# EAGLE design 6in-6out_1.1 (EAGLE 5.02)
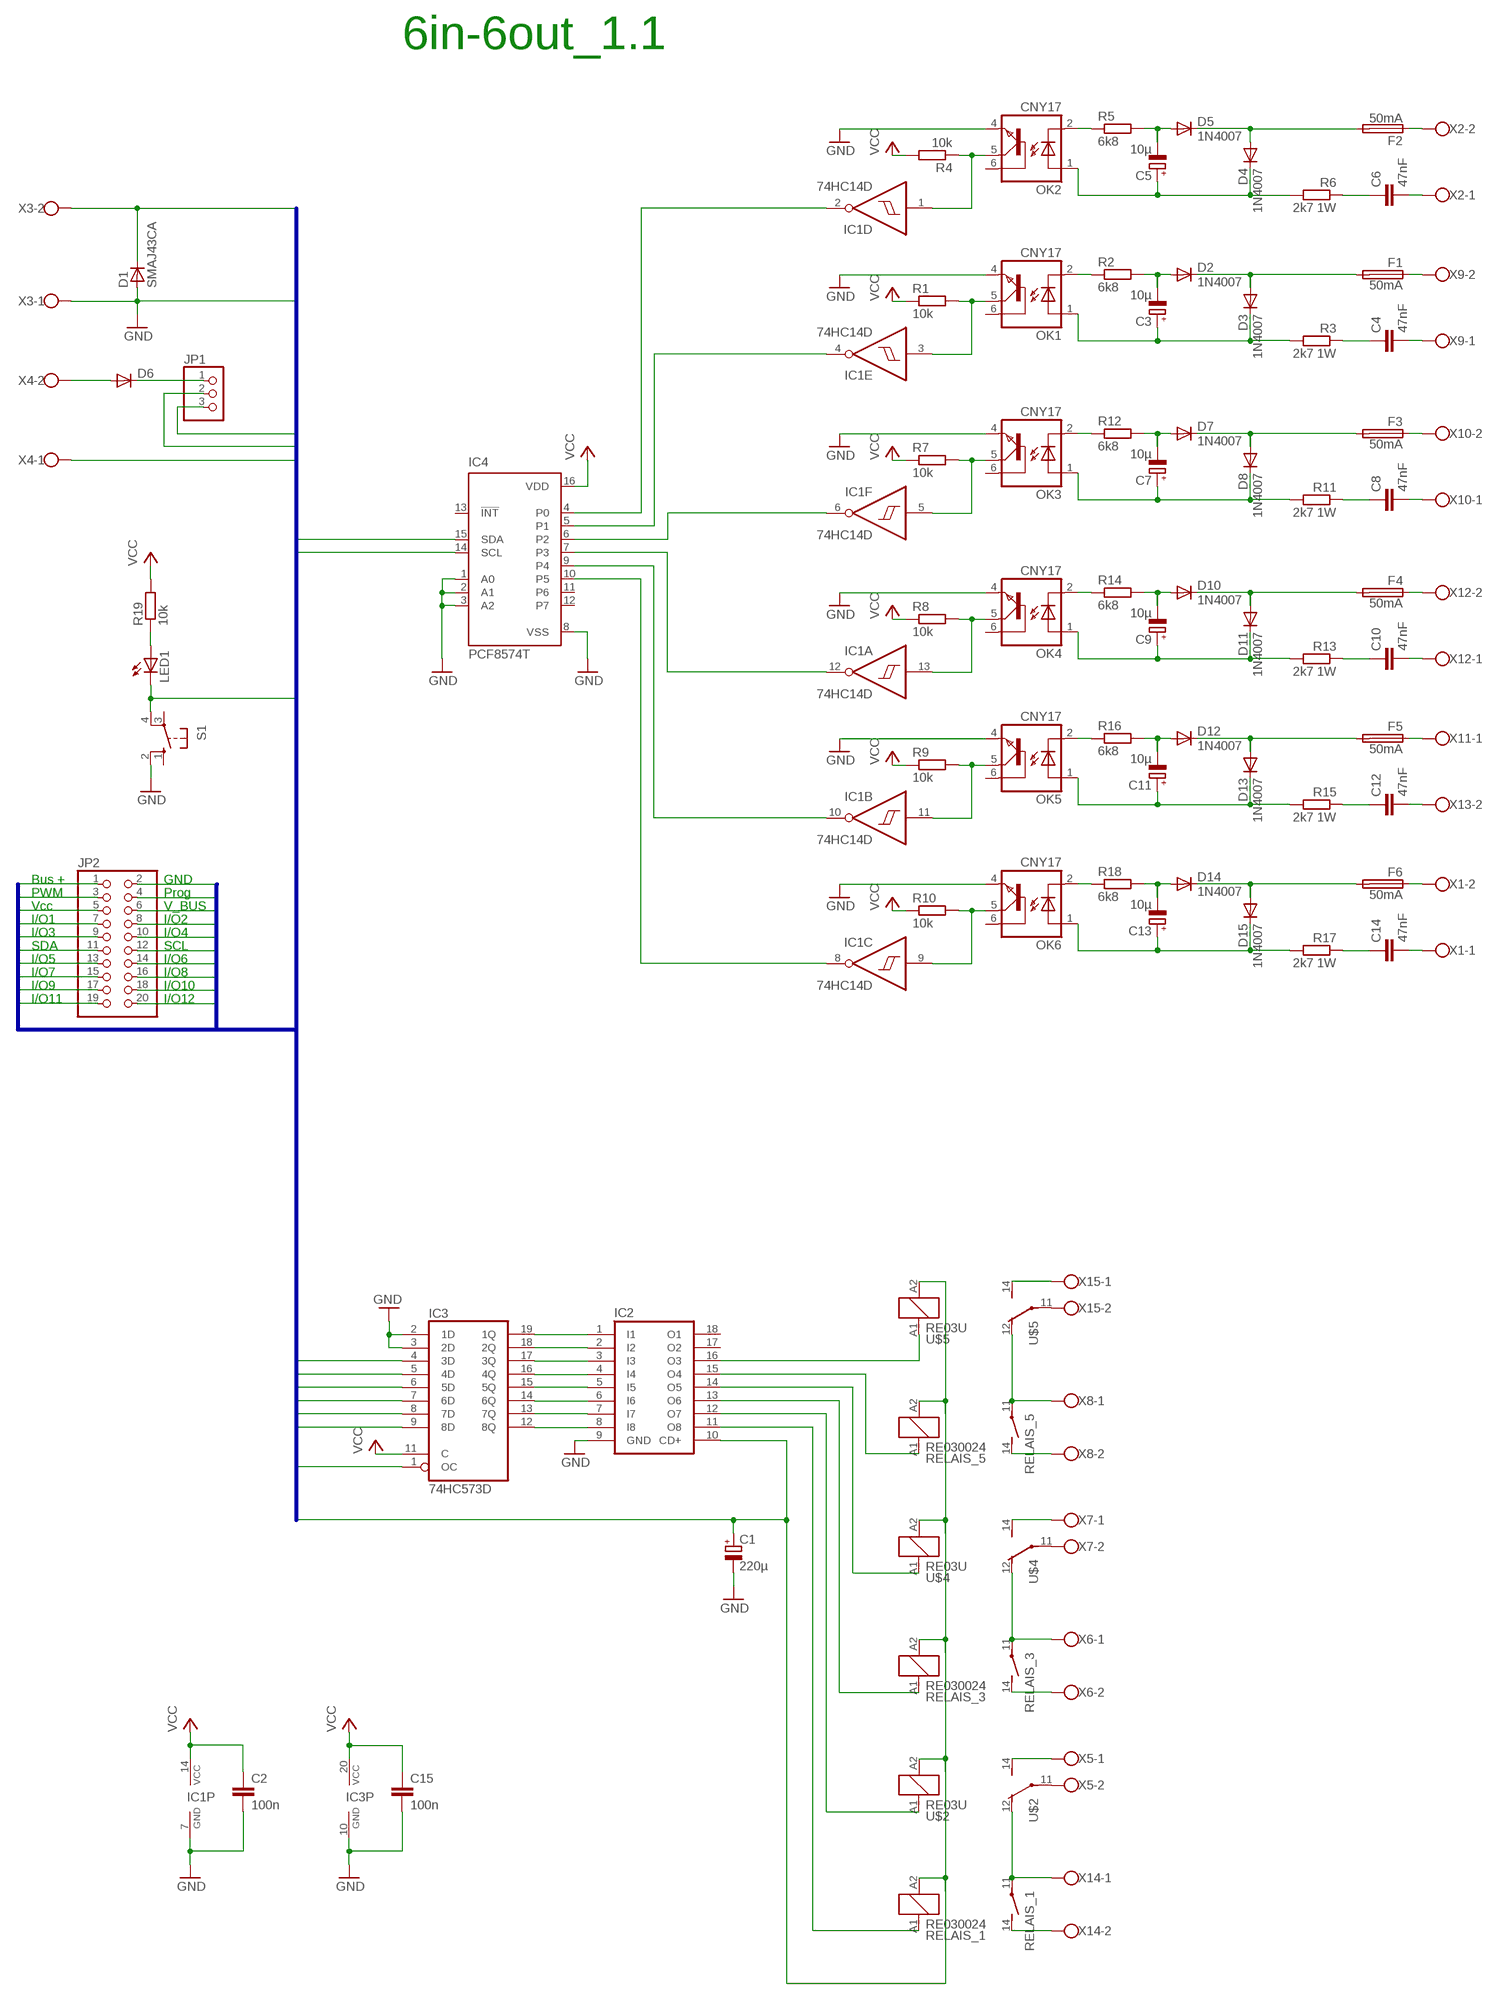
[diagram p0: schematic, sheet 1]

## Parts
C1  220µ  CPOL-EUE3.5-10  [E3,5-10]
C2  100n  C-EUC1206  [C1206]
C3  10µ  CPOL-EUE2-4  [E2-4]
C4  47nF  C-EU075-063X106  [C075-063X106]
C5  10µ  CPOL-EUE2-4  [E2-4]
C6  47nF  C-EU075-063X106  [C075-063X106]
C7  10µ  CPOL-EUE2-4  [E2-4]
C8  47nF  C-EU075-063X106  [C075-063X106]
C9  10µ  CPOL-EUE2-4  [E2-4]
C10  47nF  C-EU075-063X106  [C075-063X106]
C11  10µ  CPOL-EUE2-4  [E2-4]
C12  47nF  C-EU075-063X106  [C075-063X106]
C13  10µ  CPOL-EUE2-4  [E2-4]
C14  47nF  C-EU075-063X106  [C075-063X106]
C15  100n  C-EUC1206  [C1206]
D1  SMAJ43CA  D-SMB  [SMB]
D2  1N4007  DIODE-D-2.5  [D-2.5]
D3  1N4007  DIODE-D-2.5  [D-2.5]
D4  1N4007  DIODE-D-2.5  [D-2.5]
D5  1N4007  DIODE-D-2.5  [D-2.5]
D6  DIODE-MINIMELF  [MINIMELF]
D7  1N4007  DIODE-D-2.5  [D-2.5]
D8  1N4007  DIODE-D-2.5  [D-2.5]
D10  1N4007  DIODE-D-2.5  [D-2.5]
D11  1N4007  DIODE-D-2.5  [D-2.5]
D12  1N4007  DIODE-D-2.5  [D-2.5]
D13  1N4007  DIODE-D-2.5  [D-2.5]
D14  1N4007  DIODE-D-2.5  [D-2.5]
D15  1N4007  DIODE-D-2.5  [D-2.5]
F1  50mA  FUSE  [0617V]
F2  50mA  FUSE  [0617V]
F3  50mA  FUSE  [0617V]
F4  50mA  FUSE  [0617V]
F5  50mA  FUSE  [0617V]
F6  50mA  FUSE  [0617V]
IC1  74HC14D  [SO14]
IC2  ULN2803AD  [SO18W]
IC3  74HC573D  [SO20W]
IC4  PCF8574T  [SO16W]
JP1  PINHD-1X3  [1X03]
JP2  PINHD-2X10  [2X10]
LED1  LED3MM  [LED3MM]
OK1  CNY17  [DIL06]
OK2  CNY17  [DIL06]
OK3  CNY17  [DIL06]
OK4  CNY17  [DIL06]
OK5  CNY17  [DIL06]
OK6  CNY17  [DIL06]
R1  10k  R-EU_M1206  [M1206]
R2  6k8  R-EU_0207/2V  [0207/2V]
R3  2k7 1W  R-EU_0207/2V  [0207/2V]
R4  10k  R-EU_M1206  [M1206]
R5  6k8  R-EU_0207/2V  [0207/2V]
R6  2k7 1W  R-EU_0207/2V  [0207/2V]
R7  10k  R-EU_M1206  [M1206]
R8  10k  R-EU_M1206  [M1206]
R9  10k  R-EU_M1206  [M1206]
R10  10k  R-EU_M1206  [M1206]
R11  2k7 1W  R-EU_0207/2V  [0207/2V]
R12  6k8  R-EU_0207/2V  [0207/2V]
R13  2k7 1W  R-EU_0207/2V  [0207/2V]
R14  6k8  R-EU_0207/2V  [0207/2V]
R15  2k7 1W  R-EU_0207/2V  [0207/2V]
R16  6k8  R-EU_0207/2V  [0207/2V]
R17  2k7 1W  R-EU_0207/2V  [0207/2V]
R18  6k8  R-EU_0207/2V  [0207/2V]
R19  10k  R-EU_M1206  [M1206]
RELAIS_1  RE030024  [RE-SCHRACK]
RELAIS_3  RE030024  [RE-SCHRACK]
RELAIS_5  RE030024  [RE-SCHRACK]
S1  10-XX  [B3F-10XX]
U$2  RE03U  [G5Q_1_EU]
U$4  RE03U  [G5Q_1_EU]
U$5  RE03U  [G5Q_1_EU]
X1  W237-02P  [W237-132]
X2  W237-3E  [W237-3E]
X3  W237-02P  [W237-132]
X4  W237-02P  [W237-132]
X5  W237-02P  [W237-132]
X6  W237-02P  [W237-132]
X7  W237-02P  [W237-132]
X8  W237-02P  [W237-132]
X9  W237-3E  [W237-3E]
X10  W237-3E  [W237-3E]
X11  W237-02P  [W237-132]
X12  W237-02P  [W237-132]
X13  W237-02P  [W237-132]
X14  W237-02P  [W237-132]
X15  W237-02P  [W237-132]

## Nets
EIB+: D1.1(C) JP2.1 X3.2
GND: C1.- C2.2 C15.2 D1.2(A) IC1.7(P:GND) IC2.9(GND) IC3.2(1D) IC3.3(2D) IC3.10(GND) IC4.1(A0) IC4.2(A1) IC4.3(A2) IC4.8(VSS) JP2.2 OK1.4(EMI) OK2.4(EMI) OK3.4(EMI) OK4.4(EMI) OK5.4(EMI) OK6.4(EMI) S1.2(S1) X3.1 X4.1
IO1: JP2.7
IO2: IC3.4(3D) JP2.8
IO3: IC3.5(4D) JP2.9
IO4: IC3.6(5D) JP2.10
IO5: IC3.7(6D) JP2.13
IO6: IC3.8(7D) JP2.14
IO7: IC3.9(8D) JP2.15
IO8: JP2.16
IO9: JP2.17
IO10: JP2.18
IO11: JP2.19
IO12: JP2.20
N$1: OK1.2(C) R2.1
N$2: IC1.12(A:O) IC4.7(P3)
N$3: C3.- D2.A R2.2
N$4: OK3.2(C) R12.1
N$5: D2.C D3.A F1.2
N$6: U$2.14(14:S) X5.1
N$7: C4.1 R3.1
N$8: C7.- D7.A R12.2
N$9: D7.C D8.A F3.2
N$10: OK2.2(C) R5.1
N$11: C6.1 R6.1
N$12: D6.A X4.2
N$13: C5.- D5.A R5.2
N$14: IC2.16(O3) U$5.A1
N$15: D6.C JP1.1
N$17: IC2.15(O4) RELAIS_5.A1
N$18: D4.A D5.C F2.2
N$19: IC2.12(O7) U$2.A1
N$20: C5.+ D4.C OK2.1(A) R6.2
N$21: IC2.1(I1) IC3.19(1Q)
N$22: IC2.2(I2) IC3.18(2Q)
N$23: C7.+ D8.C OK3.1(A) R11.2
N$24: C3.+ D3.C OK1.1(A) R3.2
N$25: U$2.11(14:P) X5.2
N$26: RELAIS_5.14(2:S) X8.2
N$27: IC1.5(F:I) OK3.5(COL) R7.2
N$28: IC1.1(D:I) OK2.5(COL) R4.1
N$29: IC1.3(E:I) OK1.5(COL) R1.2
N$30: RELAIS_5.11(2:P) U$5.12(14:O) X8.1
N$31: C8.1 R11.1
N$32: U$4.11(14:P) X7.2
N$33: OK4.2(C) R14.1
N$34: C9.- D10.A R14.2
N$35: D10.C D11.A F4.2
N$36: C9.+ D11.C OK4.1(A) R13.2
N$37: IC1.13(A:I) OK4.5(COL) R8.2
N$38: C10.1 R13.1
N$39: U$4.14(14:S) X7.1
N$40: RELAIS_3.14(2:S) X6.2
N$41: OK5.2(C) R16.1
N$42: C11.- D12.A R16.2
N$43: D12.C D13.A F5.2
N$44: C11.+ D13.C OK5.1(A) R15.2
N$45: IC1.11(B:I) OK5.5(COL) R9.2
N$46: RELAIS_3.11(2:P) U$4.12(14:O) X6.1
N$47: U$5.11(14:P) X15.2
N$48: C12.1 R15.1
N$49: OK6.2(C) R18.1
N$50: C13.- D14.A R18.2
N$51: D14.C D15.A F6.2
N$52: C13.+ D15.C OK6.1(A) R17.2
N$53: IC1.9(C:I) OK6.5(COL) R10.2
N$54: U$5.14(14:S) X15.1
N$55: RELAIS_1.14(2:S) X14.2
N$56: C14.1 R17.1
N$57: RELAIS_1.11(2:P) U$2.12(14:O) X14.1
N$58: F1.1 X9.2
N$59: IC2.3(I3) IC3.17(3Q)
N$60: IC2.13(O6) RELAIS_3.A1
N$61: IC2.4(I4) IC3.16(4Q)
N$62: F2.1 X2.2
N$63: C6.2 X2.1
N$64: IC2.5(I5) IC3.15(5Q)
N$65: IC2.14(O5) U$4.A1
N$66: IC2.6(I6) IC3.14(6Q)
N$67: C4.2 X9.1
N$68: F3.1 X10.2
N$69: IC2.7(I7) IC3.13(7Q)
N$70: IC2.8(I8) IC3.12(8Q)
N$71: C8.2 X10.1
N$72: F4.1 X12.2
N$73: C10.2 X12.1
N$74: C12.2 X13.2
N$75: F5.1 X11.1
N$76: F6.1 X1.2
N$77: C14.2 X1.1
N$78: LED1.A R19.1
N$81: IC1.2(D:O) IC4.4(P0)
N$82: IC1.4(E:O) IC4.5(P1)
N$83: IC1.6(F:O) IC4.6(P2)
N$84: IC1.10(B:O) IC4.9(P4)
N$85: IC1.8(C:O) IC4.10(P5)
PROG: JP2.4
PROG1: LED1.K(C) S1.4(P1)
PWM: IC3.1(OC) JP2.3
R3: IC2.11(O8) RELAIS_1.A1
SCL: IC4.14(SCL) JP2.12
SDA: IC4.15(SDA) JP2.11
V_BUS: JP1.3 JP2.6
VCC: C2.1 C15.1 IC1.14(P:VCC) IC3.11(C) IC3.20(VCC) IC4.16(VDD) JP2.5 R1.1 R4.2 R7.1 R8.1 R9.1 R10.1 R19.2
VDD: C1.+ IC2.10(CD+) JP1.2 RELAIS_1.A2 RELAIS_3.A2 RELAIS_5.A2 U$2.A2 U$4.A2 U$5.A2
Unconnected: IC2.17(O2) IC2.18(O1) IC4.11(P6) IC4.12(P7) IC4.13(!INT) OK1.6(BAS) OK2.6(BAS) OK3.6(BAS) OK4.6(BAS) OK5.6(BAS) OK6.6(BAS) S1.1(S) S1.3(P) X2.3 X9.3 X10.3 X11.2 X13.1

## Buses
IO[1..12],PWM,PROG,VDD,VCC,GND,EIB+,V_BUS,SDA,SCL

## Notes on the sheet
- 6in-6out_1.1
- Bus + | GND
- PWM | Prog
- Vcc | V_BUS
- I/O1 | I/O2
- I/O3 | I/O4
- SDA | SCL
- I/O5 | I/O6
- I/O7 | I/O8
- I/O9 | I/O10
- I/O11 | I/O12

## Library data of the parts
C1 C3 C5 C7 C9 C11 C13 = rcl:CPOL-EU: POLARIZED CAPACITOR, European symbol
C2 C4 C6 C8 C10 C12 C14 C15 = rcl:C-EU: CAPACITOR, European symbol
D1 = semicon-smd-ipc:D-: DIODE unfilled
D2-D8 D10-D15 = diode:DIODE-: DIODE
F1-F6 = fuse:FUSE: Fuse
IC1 = 74xx-eu:74*14: Hex schmitt trigger INVERTER
IC2 = uln-udn:ULN2803A: DRIVER ARRAY
IC3 = 74xx-eu:74*573: 8-bit D latch BUS DRIVER
IC4 = micro-philips:PCF8574: I2C-Bus Remote 8-bit I/O expander http://www.semiconductors.philips.com/acrobat_download/datasheets/PCF8574_4.pdf
JP1 = pinhead:PINHD-1X3: PIN HEADER
JP2 = pinhead:PINHD-2X10: PIN HEADER
LED1 = led:LED: LED OSRAM: - CHIPLED LG R971, LG N971, LY N971, LG Q971, LY Q971, LO R971, LY R971 LH N974, LH R974 LS Q976, LO Q976, LY Q976 LO Q996 - Hyper CHIPLED LW Q18S LB Q993, LB Q99A, LB R99A - SideLED LS A670, LO A670, LY A670, LG A670, LP A670 LB A673, LV A673, LT A673, LW A673 LH A674 LY A675 LS A676, LA A676, LO A676, LY A676, LW A676 LS A679, LY A679, LG A679 - Hyper Micro SIDELED® LS Y876, LA Y876, LO Y876, LY Y876 LT Y87S - SmartLED LW L88C, LW L88S LB L89C, LB L89S, LG L890 LS L89K, LO L89K, LY L89K LS L896, LA L896, LO L896, LY L896 - TOPLED LS T670, LO T670, LY T670, LG T670, LP T670 LSG T670, LSP T670, LSY T670, LOP T670, LYG T670 LG T671, LOG T671, LSG T671 LB T673, LV T673, LT T673, LW T673 LH T674 LS T676, LA T676, LO T676, LY T676, LB T676, LH T676, LSB T676, LW T676 LB T67C, LV T67C, LT T67C, LS T67K, LO T67K, LY T67K, LW E67C LS E67B, LA E67B, LO E67B, LY E67B, LB E67C, LV E67C, LT E67C LW T67C LS T679, LY T679, LG T679 LS T770, LO T770, LY T770, LG T770, LP T770 LB T773, LV T773, LT T773, LW T773 LH T774 LS E675, LA E675, LY E675, LS T675 LS T776, LA T776, LO T776, LY T776, LB T776 LHGB T686 LT T68C, LB T68C - Hyper Mini TOPLED® LB M676 - Mini TOPLED Santana® LG M470 LS M47K, LO M47K, LY M47K Source: http://www.osram.convergy.de - LUMILED® LXK2-PW12-R00, LXK2-PW12-S00, LXK2-PW14-U00, LXK2-PW14-V00 LXK2-PM12-R00, LXK2-PM12-S00, LXK2-PM14-U00 LXK2-PE12-Q00, LXK2-PE12-R00, LXK2-PE12-S00, LXK2-PE14-T00, LXK2-PE14-U00 LXK2-PB12-K00, LXK2-PB12-L00, LXK2-PB12-M00, LXK2-PB14-N00, LXK2-PB14-P00, LXK2-PB14-Q00 LXK2-PR12-L00, LXK2-PR12-M00, LXK2-PR14-Q00, LXK2-PR14-R00 LXK2-PD12-Q00, LXK2-PD12-R00, LXK2-PD12-S00 LXK2-PH12-R00, LXK2-PH12-S00 LXK2-PL12-P00, LXK2-PL12-Q00, LXK2-PL12-R00 Source: www.luxeon.com
OK1-OK6 = optocoupler:CNY17: SIEMENS OPTO COUPLER
R1-R19 = rcl:R-EU_: RESISTOR, European symbol
RELAIS_1 RELAIS_3 RELAIS_5 = relay:RE03*: Miniature PCB Relay 1 pole 6 A SCHRACK Source: http://www.schrack.com/.. 5812.pdf
S1 = switch-omron:10-XX: OMRON SWITCH
U$2 U$4 U$5 = freebus_relay:RE03U
X1 X3-X8 X11-X15 = con-wago-508:W237-02P: WAGO SREW CLAMP
X2 X9 X10 = con-wago-508:W237-3E: WAGO SREW CLAMP

## Board
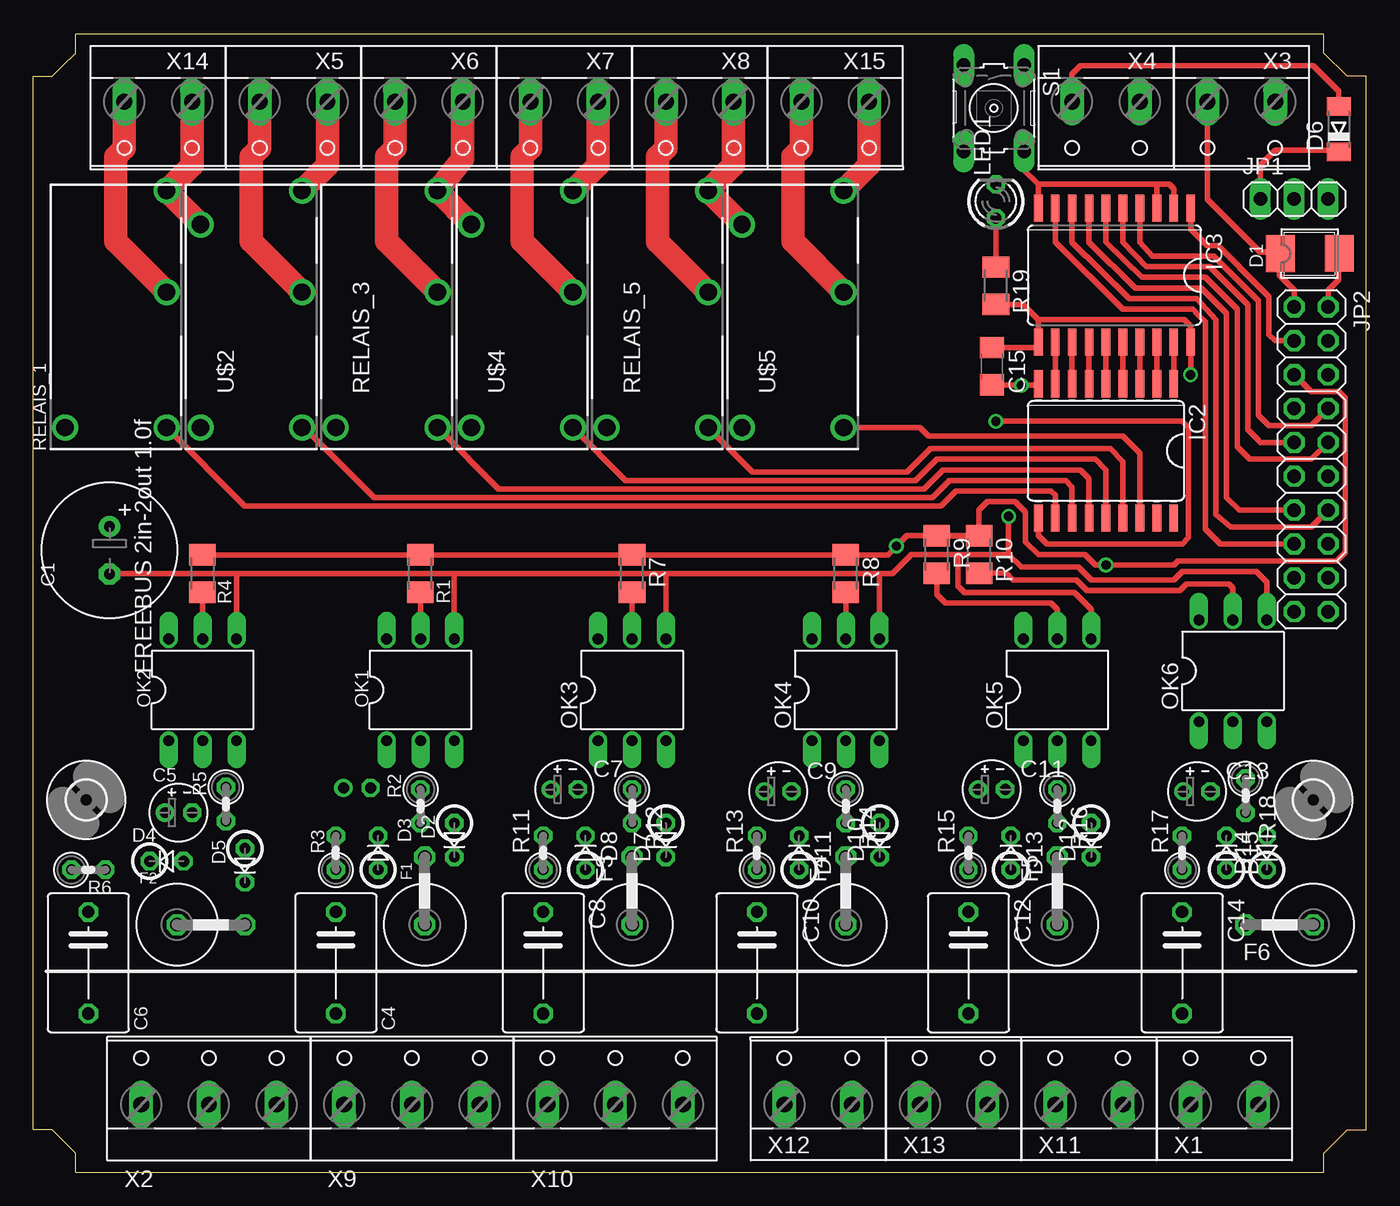
[diagram p1: board, top side]
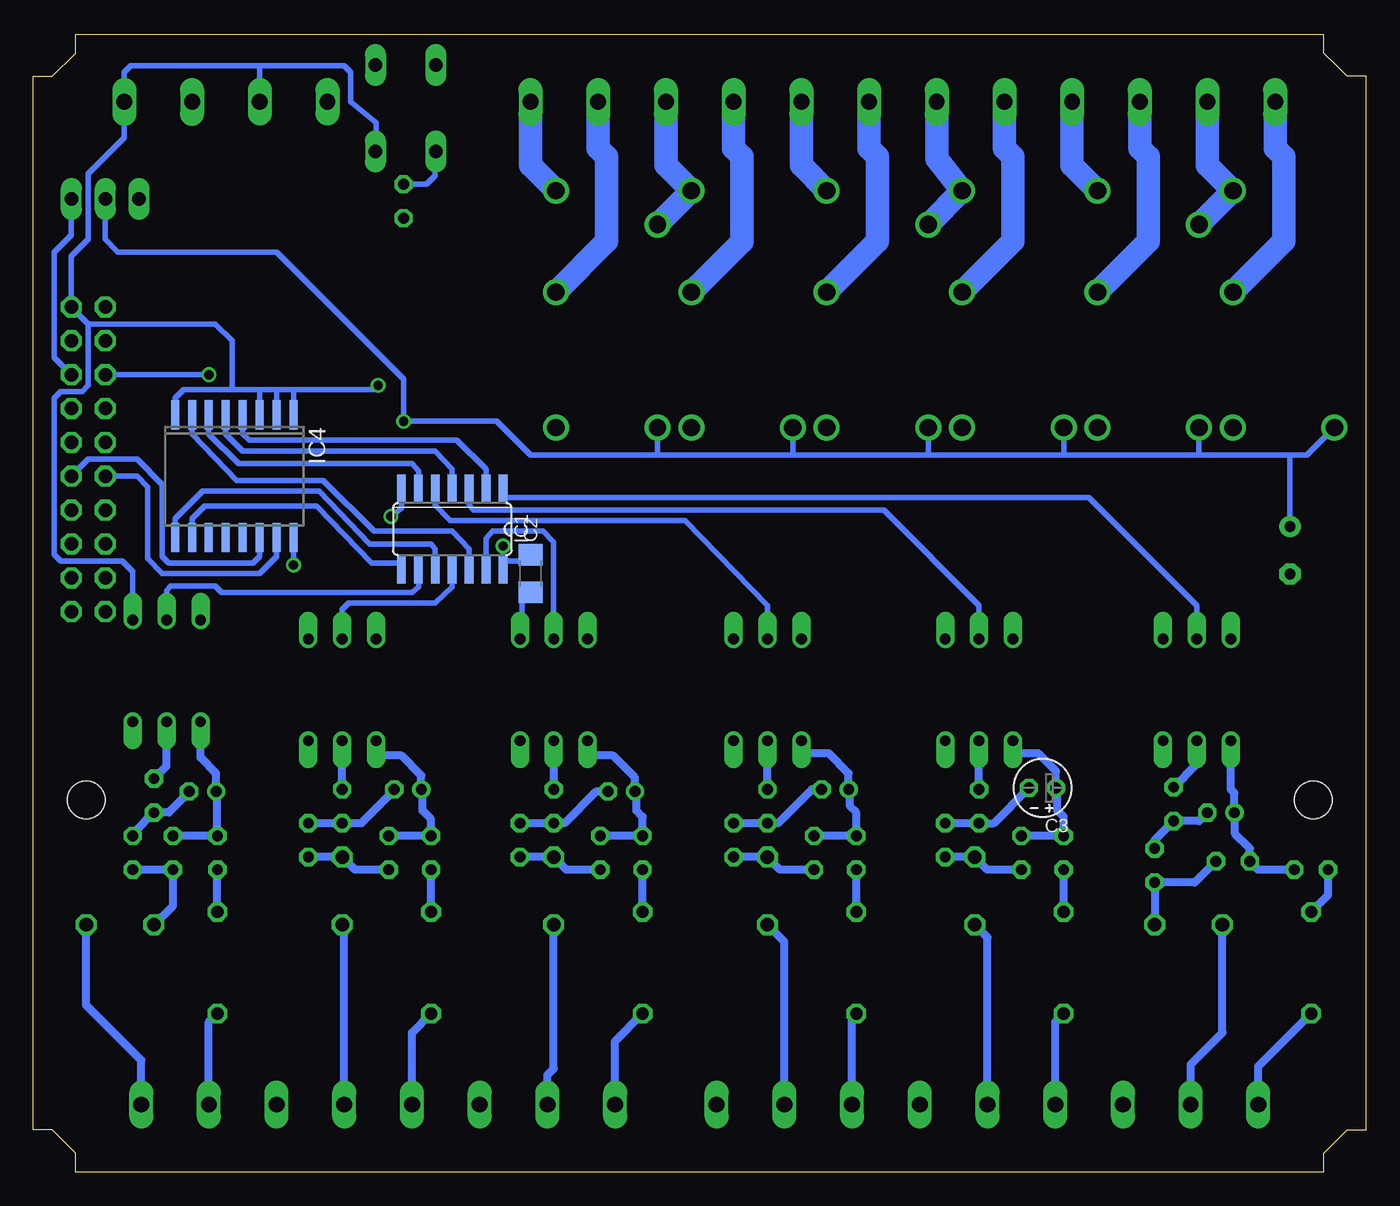
[diagram p2: board, bottom side, seen from below]

Size 100.01 x 85.41 mm. Coordinates in mm from the lower left corner, seen from the top.
Outline: 3.17,0 3.17,1.43 2.06,2.54 1.43,3.17 0,3.17 0,82.23 1.43,82.23 2.22,83.03 3.17,83.98 3.17,85.41 96.84,85.41 96.84,83.98 98.58,82.23 100.01,82.23 100.01,3.17 98.58,3.17 96.84,1.43 96.84,0 3.17,0
Copper layers (1*16): Top 0.035mm / dielectric 1.5mm / Bottom 0.035mm
Design rules "default_freebus": minimum track width 10mil, minimum drill 24mil, track to track 8mil, track to pad 8mil, pad to pad 8mil, via to via 8mil, smd to smd 8mil, copper to edge 12mil, drill to drill 8mil, minimum pad ring 11mil, minimum via ring 8mil, stop-mask expansion 4mil, vias tented up to drill 0mil, thermal gap 10mil

### Footprints (pad centres in the part's own frame; a part is rotated, then mirrored left to right if it is on the bottom)
E3,5-10 = drill 0.813 pad 1.6 round: + -1.778,0 | drill 0.813 pad 1.6 octagon: - 1.778,0
C1206 = smd 1.6 x 1.8: 1 -1.4,0; 2 1.4,0
E2-4 = drill 0.813 pad 1.27 round: + -1.016,0 | drill 0.813 pad 1.27 octagon: - 1.016,0
C075-063X106 = drill 0.914 octagon: 1 -3.81,0; 2 3.81,0
SMB = smd 2.159 x 2.743: 1 -2.311,-0.127; 2 2.108,-0.102
D-2.5 = drill 0.813 octagon: A 1.27,0; C -1.27,0
MINIMELF = smd 1.4 x 1.8: A 1.7,0; C -1.7,0
0617V = drill 1.016 octagon: 1 -2.54,0; 2 2.54,0
SO14 = smd 0.66 x 2.032: 1 -3.81,-3.073; 2 -2.54,-3.073; 3 -1.27,-3.073; 4 0,-3.073; 5 1.27,-3.073; 6 2.54,-3.073; 7 3.81,-3.073; 8 3.81,3.073; 9 2.54,3.073; 10 1.27,3.073; 11 0,3.073; 12 -1.27,3.073; 13 -2.54,3.073; 14 -3.81,3.073
SO18W = smd 0.66 x 2.032: 1 -5.08,-5.029; 2 -3.81,-5.029; 3 -2.54,-5.029; 4 -1.27,-5.029; 5 0,-5.029; 6 1.27,-5.029; 7 2.54,-5.029; 8 3.81,-5.029; 9 5.08,-5.029; 10 5.08,5.029; 11 3.81,5.029; 12 2.54,5.029; 13 1.27,5.029; 14 0,5.029; 15 -1.27,5.029; 16 -2.54,5.029; 17 -3.81,5.029; 18 -5.08,5.029
SO20W = smd 0.66 x 2.032: 1 -5.715,-5.029; 2 -4.445,-5.029; 3 -3.175,-5.029; 4 -1.905,-5.029; 5 -0.635,-5.029; 6 0.635,-5.029; 7 1.905,-5.029; 8 3.175,-5.029; 9 4.445,-5.029; 10 5.715,-5.029; 11 5.715,5.029; 12 4.445,5.029; 13 3.175,5.029; 14 1.905,5.029; 15 0.635,5.029; 16 -0.635,5.029; 17 -1.905,5.029; 18 -3.175,5.029; 19 -4.445,5.029; 20 -5.715,5.029
SO16W = smd 0.6 x 2.2: 1 -4.445,-4.6; 2 -3.175,-4.6; 3 -1.905,-4.6; 4 -0.635,-4.6; 5 0.635,-4.6; 6 1.905,-4.6; 7 3.175,-4.6; 8 4.445,-4.6; 9 4.445,4.6; 10 3.175,4.6; 11 1.905,4.6; 12 0.635,4.6; 13 -0.635,4.6; 14 -1.905,4.6; 15 -3.175,4.6; 16 -4.445,4.6
1X03 = drill 1.016 long: 1 -2.54,0; 2 0,0; 3 2.54,0
2X10 = drill 1.016 octagon: 1 -11.43,-1.27; 2 -11.43,1.27; 3 -8.89,-1.27; 4 -8.89,1.27; 5 -6.35,-1.27; 6 -6.35,1.27; 7 -3.81,-1.27; 8 -3.81,1.27; 9 -1.27,-1.27; 10 -1.27,1.27; 11 1.27,-1.27; 12 1.27,1.27; 13 3.81,-1.27; 14 3.81,1.27; 15 6.35,-1.27; 16 6.35,1.27; 17 8.89,-1.27; 18 8.89,1.27; 19 11.43,-1.27; 20 11.43,1.27
LED3MM = drill 0.813 octagon: A -1.27,0; K 1.27,0
DIL06 = drill 0.813 offset: 1 -2.54,-3.81; 2 0,-3.81; 3 2.54,-3.81; 4 2.54,3.81; 5 0,3.81; 6 -2.54,3.81
M1206 = smd 1.6 x 2: 1 -1.4,0; 2 1.4,0
0207/2V = drill 0.813 octagon: 1 -1.27,0; 2 1.27,0
RE-SCHRACK = drill 1.3 round: 11 8.89,-3.81; 14 1.27,-3.81; A1 -8.89,-3.81; A2 -8.89,3.81
B3F-10XX = drill 1.016 long: 1 -3.251,2.261; 2 3.251,2.261; 3 -3.251,-2.261; 4 3.251,-2.261
2,8 = hole 2.8: 0,0
G5Q_1_EU = drill 1.3 round: 11 1.27,-3.81; 12 6.35,3.81; 14 8.89,-3.81; A1 -8.89,-3.81; A2 -8.89,3.81
W237-132 = drill 1.194 long: 1 -2.54,-0.635; 2 2.54,-0.635
W237-3E = drill 1.194 long: 1 -5.08,-0.635; 2 0,-0.635; 3 5.08,-0.635

### Placement (x,y rotation side)
C1  5.71,46.67 270 top
C2  62.71,44.93 270 bottom
C3  24.29,28.84 180 bottom
C4  22.7,15.72 270 top
C5  10.9,26.99 0 top
C6  4.13,15.72 270 top
C7  39.85,28.73 0 top
C8  38.26,15.72 270 top
C9  55.88,28.58 0 top
C10  54.29,15.72 270 top
C11  71.91,28.73 0 top
C12  70.17,15.72 270 top
C13  87.31,28.58 0 top
C14  86.2,15.72 270 top
C15  71.91,60.48 270 top
D1  95.88,69.06 0 top
D2  31.59,24.92 90 top
D3  25.88,23.97 270 top
D4  10,23.34 0 top
D5  15.88,23.02 90 top
D6  97.95,78.26 90 top
D7  47.47,24.92 90 top
D8  41.43,23.97 270 top
D10  63.5,24.92 90 top
D11  57.47,23.97 270 top
D12  79.38,24.92 90 top
D13  73.34,23.97 270 top
D14  92.55,23.97 90 top
D15  89.53,23.97 270 top
F1  29.37,21.11 90 top
F2  13.33,18.57 0 top
F3  44.93,21.11 90 top
F4  60.96,21.11 90 top
F5  76.83,21.11 90 top
F6  93.5,18.57 180 top
IC1  68.58,48.26 180 bottom
IC2  80.49,54.13 180 top
IC3  81.12,67.31 180 top
IC4  84.93,52.23 180 bottom
JP1  94.62,73.03 0 top
JP2  95.88,53.5 270 top
LED1  72.23,72.87 90 top
OK1  29.05,36.19 0 top
OK2  12.7,36.19 0 top
OK3  44.93,36.19 0 top
OK4  60.96,36.19 0 top
OK5  76.83,36.19 0 top
OK6  90.01,37.62 0 top
R1  29.05,44.93 270 top
R2  29.05,27.46 270 top
R3  22.7,23.97 90 top
R4  12.7,44.93 90 top
R5  14.45,27.62 270 top
R6  4.13,22.7 0 top
R7  44.93,44.93 270 top
R8  60.96,44.93 270 top
R9  67.79,46.35 270 top
R10  70.96,46.35 270 top
R11  38.26,23.97 90 top
R12  44.93,27.46 270 top
R13  54.29,23.97 90 top
R14  60.96,27.46 270 top
R15  70.17,23.97 90 top
R16  76.83,27.46 270 top
R17  86.2,23.97 90 top
R18  90.96,28.26 270 top
R19  72.23,66.52 270 top
RELAIS_1  6.19,64.77 90 top
RELAIS_3  26.51,64.77 90 top
RELAIS_5  46.83,64.77 90 top
S1  72.07,79.85 270 top
U$1  [2,8]  3.97,27.94 0 top
U$2  16.35,64.77 90 top
U$3  [2,8]  96.04,27.94 0 top
U$4  36.67,64.77 90 top
U$5  56.99,64.77 90 top
X1  89.38,5.72 0 top
X2  13.18,5.72 0 top
X3  90.65,79.69 180 top
X4  80.49,79.69 180 top
X5  19.53,79.69 180 top
X6  29.69,79.69 180 top
X7  39.85,79.69 180 top
X8  50.01,79.69 180 top
X9  28.42,5.72 0 top
X10  43.66,5.72 0 top
X11  79.22,5.72 0 top
X12  58.9,5.72 0 top
X13  69.06,5.72 0 top
X14  9.37,79.69 180 top
X15  60.17,79.69 180 top

### Tracks (layer width: path | path; a pad name or v marks a point on that pad's centre or on a via)
EIB+
  Top 0.406: JP2.1 | JP2.1 94.61,66.2 93.5,67.31 93.5,68.93 | 93.5,68.93 93.5,69.06 92.08,69.06 88.11,73.02 X3.2 | 93.5,68.93 D1.1 | X3.2
GND  (via drill 0.7, 0.7 pad 0.61)
  Top 0.406: IC3.10 | 75.41,74.14 IC3.10 | IC3.2 | 75.41,74.14 84.3,74.14 | OK2.4 | 15.24,44.93 OK2.4 | OK1.4 | 15.24,44.93 31.59,44.93 | 31.59,44.93 OK1.4 | OK3.4 | 47.47,44.93 OK3.4 | 31.59,44.93 47.47,44.93 | OK4.4 | 63.5,44.93 OK4.4 | 47.47,44.93 63.5,44.93 | C1.- 5.71,44.93 15.24,44.93 | C1.- | OK5.4 79.38,42.23 78.9,42.7 | 78.9,42.7 78.11,43.5 69.85,43.5 69.37,43.97 69.37,46.35 | 78.9,42.7 | 69.37,46.35 65.88,46.35 64.45,44.93 63.5,44.93 | 73.18,46.35 74.14,45.4 78.42,45.4 79.38,44.45 85.57,44.45 86.2,45.08 91.76,45.08 92.55,44.29 OK6.4 | 69.37,46.35 73.18,46.35 | JP2.2 | JP2.2 97.16,66.2 97.95,66.99 97.95,68.95 | 97.95,68.95 97.95,69.06 | IC3.3 | 84.3,74.14 IC3.3 | IC3.2 85.57,73.82 85.25,74.14 84.3,74.14 | 97.95,68.95 D1.2 | S1.2 74.3,76.6 74.3,75.25 75.41,74.14 | C15.2 74.14,59.08 v74.14,59.05 75.41,59.05 IC2.9 | IC2.9 | OK6.4 | 73.18,46.35 v73.18,49.21 | v73.18,49.21
  Bottom 0.406: X3.1 93.19,82.55 92.71,83.03 83.03,83.03 | X4.1 | X4.1 | 83.03,83.03 X4.1 | S1.2 74.3,76.6 74.3,78.74 76.2,80.33 76.2,82.55 76.68,83.03 83.03,83.03 | X3.1 | X3.1 93.19,77.63 95.89,74.93 95.89,70.01 97.16,68.74 JP2.2 | IC4.8 89.38,58.1 88.74,58.74 85.09,58.74 | 85.09,58.74 85.09,62.39 86.36,63.66 95.89,63.66 | JP2.2 | JP2.2 | 95.89,63.66 JP2.2 | IC4.1 | 80.49,58.74 IC4.1 | 81.76,58.74 80.49,58.74 | 83.03,58.74 81.76,58.74 | 85.09,58.74 83.03,58.74 | IC4.3 | 83.03,58.74 IC4.3 | IC4.2 | 81.76,58.74 IC4.2 | 80.49,58.74 74.45,58.74 v74.14,59.05 | OK4.4 63.34,40 63.34,43.53 C2.2 | OK6.4 | OK6.4 92.55,45.08 93.34,45.88 97.95,45.88 98.42,46.35 98.42,58.1 97.95,58.58 96.36,58.58 95.89,59.05 95.89,63.66 | v73.18,49.21 72.39,49.85 72.39,51.28 IC1.7
IO2
  Top 0.406: JP2.8 95.89,56.04 92.71,56.04 91.92,56.83 91.92,65.4 90.81,66.52 88.58,68.74 83.98,68.74 83.03,69.8 IC3.4
IO3
  Top 0.406: JP2.9 92.08,54.77 91.92,54.93 91.12,55.72 91.12,65.09 88.27,67.94 83.5,67.94 81.76,69.8 IC3.5
IO4
  Top 0.406: JP2.10 95.89,53.5 91.28,53.5 90.33,54.45 90.33,64.77 89.69,65.4 87.95,67.15 83.19,67.15 80.49,69.8 IC3.6
IO5
  Top 0.406: JP2.13 90.65,49.69 90.49,49.69 89.53,50.64 89.53,64.45 87.63,66.36 82.71,66.36 79.22,69.8 IC3.7
IO6
  Top 0.406: JP2.14 95.89,48.42 89.85,48.42 88.74,49.37 88.74,63.98 87.31,65.56 82.23,65.56 77.95,69.8 IC3.8
IO7
  Top 0.406: JP2.15 89.22,47.15 89.06,47.15 87.95,48.26 87.95,63.82 87.47,64.29 87,64.77 81.76,64.77 76.68,69.8 IC3.9
N$1
  Bottom 0.61: OK1.2 | OK1.2 | R2.1 OK1.2 | OK1.2
N$2
  Bottom 0.406: IC4.7 88.11,55.4 84.77,51.91 78.26,51.91 74.45,48.1 68.58,48.1 67.31,46.77 IC1.12
N$3
  Bottom 0.61: 28.89,26.19 | 28.89,26.19 R2.2 27.94,26.19 C3.- | 28.89,26.19 D2.A | 28.89,26.19 | C3.- 25.24,28.89 | C3.-
N$4
  Bottom 0.61: R12.1 OK3.2 | OK3.2
N$5
  Bottom 0.61: F1.2 | D3.A 28.42,22.7 F1.2 | D2.C 31.43,23.65 F1.2
N$6
  Top 1.778: U$2.14 | U$2.14 22.07,75.56 X5.1
  Bottom 1.778: U$2.14 | U$2.14 22.07,75.56 X5.1
N$7
  Bottom 0.61: R3.1 | C4.1 R3.1 | R3.1
N$8
  Bottom 0.61: R12.2 D7.A | R12.2 | R12.2 44.13,26.19 41.59,28.73 40.8,28.73 | 40.8,28.73 | C7.- 40.8,28.73
N$9
  Bottom 0.61: F3.2 | D8.A 43.97,22.7 F3.2 | D7.C | F3.2 D7.C | D7.C
N$10
  Bottom 0.61: R5.1 | R5.1 12.7,30.64 OK2.2 | OK2.2 | OK2.2
N$11
  Bottom 0.61: C6.1 | C6.1 2.86,20.8 R6.1 | R6.1
N$12
  Top 0.406: X4.2 | X4.2 77.95,82.39 78.58,83.03 96.04,83.03 97.95,81.12 D6.A
N$13
  Bottom 0.61: R5.2 | R5.2 | D5.A 15.88,24.92 R5.2 | 11.91,26.99 | C5.- 11.91,26.99 | R5.2 12.54,26.35 11.91,26.99
N$14
  Top 0.406: IC2.16 | U$5.A1 66.52,55.88 67.15,55.24 81.76,55.24 83.03,53.97 IC2.16 | U$5.A1
N$15
  Top 0.406: D6.C 97.47,76.56 | JP1.1 92.08,73.82 92.08,75.56 93.19,76.68 97.95,76.68 D6.C | D6.C 97.95,76.52
N$17
  Top 0.406: IC2.15 | IC2.15 81.76,53.34 80.8,54.29 67.31,54.29 65.56,52.55 53.98,52.55 RELAIS_5.A1
N$18
  Bottom 0.61: D5.C | D5.C F2.2 | D5.C | D5.C 12.86,21.75 D4.A
N$19
  Top 0.406: IC2.12 | IC2.12 77.95,51.43 77.47,51.91 68.74,51.91 67.47,50.64 25.56,50.64 20.16,56.04 U$2.A1
N$20
  Bottom 0.61: R6.2 8.1,22.7 D4.C 8.73,24.29 9.84,25.4 9.84,26.99 C5.+ 9.89,28.46 10.16,28.73 OK2.1 | OK2.1 | OK2.1
N$21
  Top 0.406: IC2.1 | IC3.19 85.57,61.8 IC2.1
N$22
  Top 0.406: IC2.2 | IC3.18 84.3,62.12 IC2.2
N$23
  Bottom 0.61: D8.C 41.27,25.24 R11.2 38.26,26.99 38.73,27.46 38.73,28.73 | 38.73,28.73 | 38.73,28.73 C7.+ 38.83,29.94 40.32,31.43 42.39,31.43 OK3.1 | OK3.1
N$24
  Bottom 0.61: R3.2 | R3.2 | R3.2 D3.C | R3.2 22.7,26.67 23.18,27.15 23.18,28.73 23.27,28.83 C3.+ 23.27,30.1 24.61,31.43 26.51,31.43 OK1.1 | OK1.1 | OK1.1
N$25
  Top 1.778: U$2.11 | U$2.11 16.35,69.85 16.35,76.2 16.99,76.83 X5.2 | X5.2
  Bottom 1.778: U$2.11 16.35,69.85 16.35,76.2 16.99,76.83 X5.2
N$26
  Top 1.778: X8.2 47.47,76.83 46.83,76.2 46.83,69.85 RELAIS_5.14
  Bottom 1.778: RELAIS_5.14 46.83,69.85 46.83,76.2 47.47,76.83 X8.2
N$27
  Top 0.406: OK3.5 | R7.2 | OK3.5 R7.2
  Bottom 0.406: IC1.5 69.85,50.06 68.74,48.89 51.12,48.89 44.93,42.54 OK3.5 | OK3.5
N$28
  Top 0.406: OK2.5 | R4.1 12.7,43.37 OK2.5
  Bottom 0.406: IC1.1 64.77,50.64 20.8,50.64 12.7,42.54 OK2.5 | OK2.5
N$29
  Top 0.406: OK1.5 | R1.2 | OK1.5 R1.2
  Bottom 0.406: IC1.3 67.31,50.06 66.99,49.69 36.2,49.69 29.05,42.54 OK1.5 | OK1.5
N$30
  Top 1.778: X8.1 52.55,75.56 RELAIS_5.11 U$5.12
  Bottom 1.778: RELAIS_5.11 52.55,75.56 X8.1 | RELAIS_5.11 | U$5.12 RELAIS_5.11
N$31
  Bottom 0.61: C8.1 R11.1 | R11.1
N$32
  Top 1.778: U$4.11 36.67,69.85 36.67,76.2 37.31,76.83 X7.2 | X7.2
  Bottom 1.778: U$4.11 | U$4.11 36.67,69.85 36.67,76.2 37.31,76.83 X7.2
N$33
  Bottom 0.61: OK4.2 | OK4.2 | OK4.2 R14.1
N$34
  Bottom 0.61: R14.2 D10.A | R14.2 | R14.2 60.17,26.19 57.78,28.57 56.83,28.57 | 56.83,28.57 | C9.- 56.83,28.57
N$35
  Bottom 0.61: F4.2 | D11.A 60.01,22.7 F4.2 | D10.C | F4.2 D10.C | D10.C
N$36
  Bottom 0.61: D11.C R13.2 54.29,26.67 54.77,27.15 54.77,28.57 | 54.77,28.57 | 54.77,28.57 C9.+ 54.86,29.62 56.52,31.27 58.42,31.27 OK4.1 | OK4.1 | OK4.1
N$37
  Top 0.406: OK4.5 | R8.2 | OK4.5 R8.2
  Bottom 0.406: OK4.5 | OK4.5 60.96,47.31 61.75,48.1 65.56,48.1 66.04,47.57 IC1.13
N$38
  Bottom 0.61: R13.1 C10.1
N$39
  Top 1.778: U$4.14 42.39,75.56 X7.1
  Bottom 1.778: U$4.14 42.39,75.56 X7.1
N$40
  Top 1.778: RELAIS_3.14 26.51,69.85 26.51,76.2 27.15,76.83 27.15,80.17 X6.2 | X6.2 | X6.2
  Bottom 1.778: X6.2 27.15,80.17 27.15,76.83 26.51,76.2 26.51,69.85 RELAIS_3.14
N$41
  Bottom 0.61: OK5.2 | R16.1 OK5.2 | OK5.2
N$42
  Bottom 0.61: R16.2 | R16.2 D12.A | R16.2 | C11.- 72.87,28.73 75.41,26.19 R16.2
N$43
  Bottom 0.61: F5.2 D12.C | F5.2 | F5.2 | D13.A 75.88,22.7 F5.2
N$44
  Bottom 0.61: D13.C | D13.C R15.2 70.17,26.51 70.8,27.15 70.8,28.73 C11.+ 70.9,29.78 72.39,31.27 74.3,31.27 OK5.1 | OK5.1
N$45
  Top 0.406: R9.2 67.79,43.34 68.42,42.7 76.36,42.7 76.83,42.23 76.83,40.8 OK5.5 76.83,39.85
  Bottom 0.406: OK5.5 76.83,42.23 76.36,42.7 69.85,42.7 68.58,43.92 IC1.11
N$46
  Top 1.778: X6.1 | X6.1 32.23,76.04 | 32.23,76.04 | 32.23,76.04 RELAIS_3.11 U$4.12
  Bottom 1.778: X6.1 | X6.1 32.23,76.04 RELAIS_3.11 U$4.12
N$47
  Top 1.778: U$5.11 56.99,69.85 56.99,76.2 57.63,76.83 X15.2
  Bottom 1.778: U$5.11 | U$5.11 56.99,69.85 56.99,76.2 57.63,76.83 X15.2
N$48
  Bottom 0.61: R15.1 | C12.1 R15.1
N$49
  Bottom 0.61: R18.1 90.01,30.48 OK6.2 | OK6.2
N$50
  Bottom 0.61: D14.A 92.55,25.4 R18.2 89.85,26.99 88.27,28.57 C13.-
N$51
  Bottom 0.61: D14.C D15.A | F6.2 | F6.2 89.53,20 D15.A | D15.A
N$52
  Bottom 0.61: 86.2,28.57 C13.+ 86.3,29.94 87.47,31.11 OK6.1 | 86.2,28.57 R17.2 D15.C | 86.2,28.57 | D15.C | D15.C | OK6.1
N$53
  Top 0.406: OK6.5 | OK6.5 90.01,43.84 89.85,44 89.69,44.13 86.52,44.13 86.04,43.66 79.06,43.66 78.26,44.45 73.5,44.45 73.03,44.95 R10.2
  Bottom 0.406: OK6.5 | OK6.5 90.01,43.66 89.69,43.97 86.36,43.97 85.88,43.5 71.6,43.5 71.12,43.92 IC1.9
N$54
  Top 1.778: U$5.14 62.71,75.56 X15.1
  Bottom 1.778: U$5.14 62.71,75.56 X15.1
N$55
  Top 1.778: X14.2 6.83,76.83 6.19,76.2 6.19,69.85 RELAIS_1.14
  Bottom 1.778: RELAIS_1.14 6.19,69.85 6.19,76.2 6.83,76.83 X14.2
N$56
  Bottom 0.61: C14.1 R17.1 | R17.1
N$57
  Top 1.778: X14.1 11.91,75.56 RELAIS_1.11 U$2.12 | U$2.12
  Bottom 1.778: RELAIS_1.11 11.91,75.56 X14.1 | RELAIS_1.11 | U$2.12 RELAIS_1.11
N$58
  Bottom 0.61: F1.1 | X9.2 28.42,17.62 F1.1
N$59
  Top 0.406: IC2.3 | IC3.17 83.03,62.12 IC2.3
N$60
  Top 0.406: IC2.13 | RELAIS_3.A1 34.92,51.28 66.83,51.28 68.26,52.7 78.58,52.7 79.22,52.07 IC2.13
N$61
  Top 0.406: IC2.4 | IC3.16 81.76,62.12 IC2.4
N$62
  Bottom 0.61: X2.2 13.18,8.1 10.79,10.48 F2.1 | F2.1
N$63
  Bottom 0.61: C6.2 | X2.1 8.1,7.94 C6.2
N$64
  Top 0.406: IC2.5 | IC3.15 80.49,61.96 IC2.5
N$65
  Top 0.406: IC2.14 | IC2.14 80.49,52.7 79.69,53.5 67.79,53.5 66.2,51.91 44.45,51.91 U$4.A1 | U$4.A1
N$66
  Top 0.406: IC2.6 | IC3.14 79.22,62.12 IC2.6
N$67
  Bottom 0.61: C4.2 | X9.1 23.34,11.27 C4.2
N$68
  Bottom 0.61: F3.1 | X10.2 43.66,17.3 F3.1
N$69
  Top 0.406: IC2.7 | IC3.13 77.95,62.12 IC2.7
N$70
  Top 0.406: IC2.8 | IC3.12 76.68,61.96 IC2.8
N$71
  Bottom 0.61: C8.2 | X10.1 38.58,11.59 C8.2
N$72
  Bottom 0.61: X12.2 61.44,7.3 60.96,7.78 F4.1
N$73
  Bottom 0.61: X12.1 56.36,9.84 C10.2
N$74
  Bottom 0.61: X13.2 71.6,10.48 C12.2
N$75
  Bottom 0.61: F5.1 | X11.1 76.68,18.41 F5.1
N$76
  Bottom 0.61: F6.1 96.04,12.54 91.92,8.41 X1.2 | X1.2 | X1.2
N$77
  Bottom 0.61: C14.2 | X1.1 86.84,11.27 C14.2
N$78
  Top 0.406: LED1.A | R19.1 LED1.A
N$81
  Bottom 0.406: IC1.2 66.04,52.76 68.26,54.93 83.82,54.93 84.3,55.4 | 84.3,55.4 IC4.4 | 84.3,55.4 IC4.4
N$82
  Bottom 0.406: IC1.4 68.58,52.76 69.85,54.13 84.3,54.13 85.57,55.4 | 85.57,55.4 IC4.5 | 85.57,55.4 IC4.5
N$83
  Bottom 0.406: IC1.6 71.12,52.6 71.6,53.18 76.83,53.18 84.61,53.18 86.84,55.4 | 86.84,55.4 IC4.6 | 86.84,55.4 IC4.6
N$84
  Bottom 0.406: IC4.9 89.38,49.06 87.31,51.12 78.58,51.12 74.77,47.15 70.17,47.15 69.85,46.77 IC1.10
N$85
  Bottom 0.406: IC1.8 72.39,45.5 72.39,45.72 74.61,45.72 78.74,50.01 87.15,50.01 88.11,49.06 | 88.11,49.06 IC4.10 | 88.11,49.06 IC4.10
PROG1
  Bottom 0.406: 69.85,76.6 69.85,76.68 | 69.85,76.6 S1.4 | LED1.K 70.48,74.14 69.85,74.77 69.85,76.6
PWM
  Top 0.406: JP2.3 93.19,62.39 92.71,62.86 92.71,65.72 92.08,66.36 88.9,69.53 88.11,69.53 86.84,70.75 IC3.1
R3
  Top 0.406: IC2.11 | RELAIS_1.A1 | IC2.11 76.68,50.8 76.36,51.12 69.22,51.12 68.1,50.01 15.88,50.01 RELAIS_1.A1
SCL
  Bottom 0.406: IC4.14 83.03,46.2 83.5,45.72 89.85,45.72 90.33,46.2 90.33,51.59 92.23,53.5 95.89,53.5 JP2.12 | JP2.12
SDA
  Bottom 0.406: IC4.15 81.76,46.2 83.03,44.93 90.33,44.93 91.44,46.04 91.44,51.43 92.23,52.23 JP2.11
V_BUS
  Bottom 0.406: JP2.6 98.42,61.12 98.42,69.06 97.16,70.33 JP1.3 | JP1.3
VCC  (via drill 0.7)
  Top 0.406: IC3.20 86.84,62.44 86.84,63.5 86.36,63.98 86.2,63.98 75.41,63.98 | R4.2 R1.1 | R1.1 29.05,46.2 | R1.1 | R1.1 | R1.1 R7.1 61.12,46.33 | R1.1 29.05,46.35 | 61.12,46.33 61.12,46.2 | 61.12,46.33 R8.1 64.14,46.33 v64.77,46.99 65.56,47.78 69.85,47.78 69.85,47.75 R9.1 R10.1 70.96,47.78 | 61.12,46.33 | JP2.5 | JP2.5 95.89,58.58 97.95,58.58 98.42,58.1 98.42,46.51 97.79,45.88 85.88,45.88 85.57,45.56 v80.49,45.56 79.69,45.56 78.9,46.35 75.41,46.35 74.45,47.31 74.45,49.53 | C15.1 75.41,61.88 IC3.11 | IC3.11 | 75.41,63.98 IC3.11 | 75.41,63.98 | 75.41,63.98 74.3,65.09 72.23,65.09 R19.2 | IC3.20 | v86.84,59.85 IC3.20 | 74.45,49.53 | 74.45,49.53 73.66,50.32 71.6,50.32 70.96,49.69 70.96,47.78 | 70.96,47.78
  Bottom 0.406: JP2.5 | JP2.5 | JP2.5 v86.84,59.85 | IC1.14 64.77,45.88 | v64.77,46.99 64.77,45.88 | C2.1 62.87,46.33 62.87,45.88 64.77,45.88 | IC4.16 | v80.49,45.56 IC4.16
VDD  (via drill 0.7)
  Top 0.406: IC2.10 75.41,47.78 76.04,47.15 86.2,47.15 86.68,47.62 86.68,55.88 86.2,56.36 v72.23,56.36
  Bottom 0.406: RELAIS_1.A2 | RELAIS_1.A2 4.45,53.82 5.71,53.82 | 5.71,53.82 12.54,53.82 | 43.02,53.82 RELAIS_5.A2 | 22.7,53.82 32.86,53.82 | 32.86,53.82 43.02,53.82 | C1.+ | C1.+ 5.71,53.82 | 12.54,53.97 | 12.54,53.82 12.54,53.97 | 12.54,53.97 U$2.A2 | 12.54,53.82 22.7,53.82 | 22.7,53.82 RELAIS_3.A2 | 22.7,53.82 | 32.86,53.82 32.86,53.97 | 32.86,53.97 U$4.A2 | 32.86,53.97 | 43.02,53.82 53.18,53.82 | 53.18,53.82 U$5.A2 | 53.18,53.82 | 53.18,53.82 62.71,53.82 65.25,56.36 v72.23,56.36 72.23,59.53 81.76,69.06 93.66,69.06 94.61,70.01 JP1.2 | JP1.2

### Text on the board
tNames: FREEBUS 2in-2out 1.0f